# EAGLE design HEXTIr_v1 (EAGLE 7.7.0)
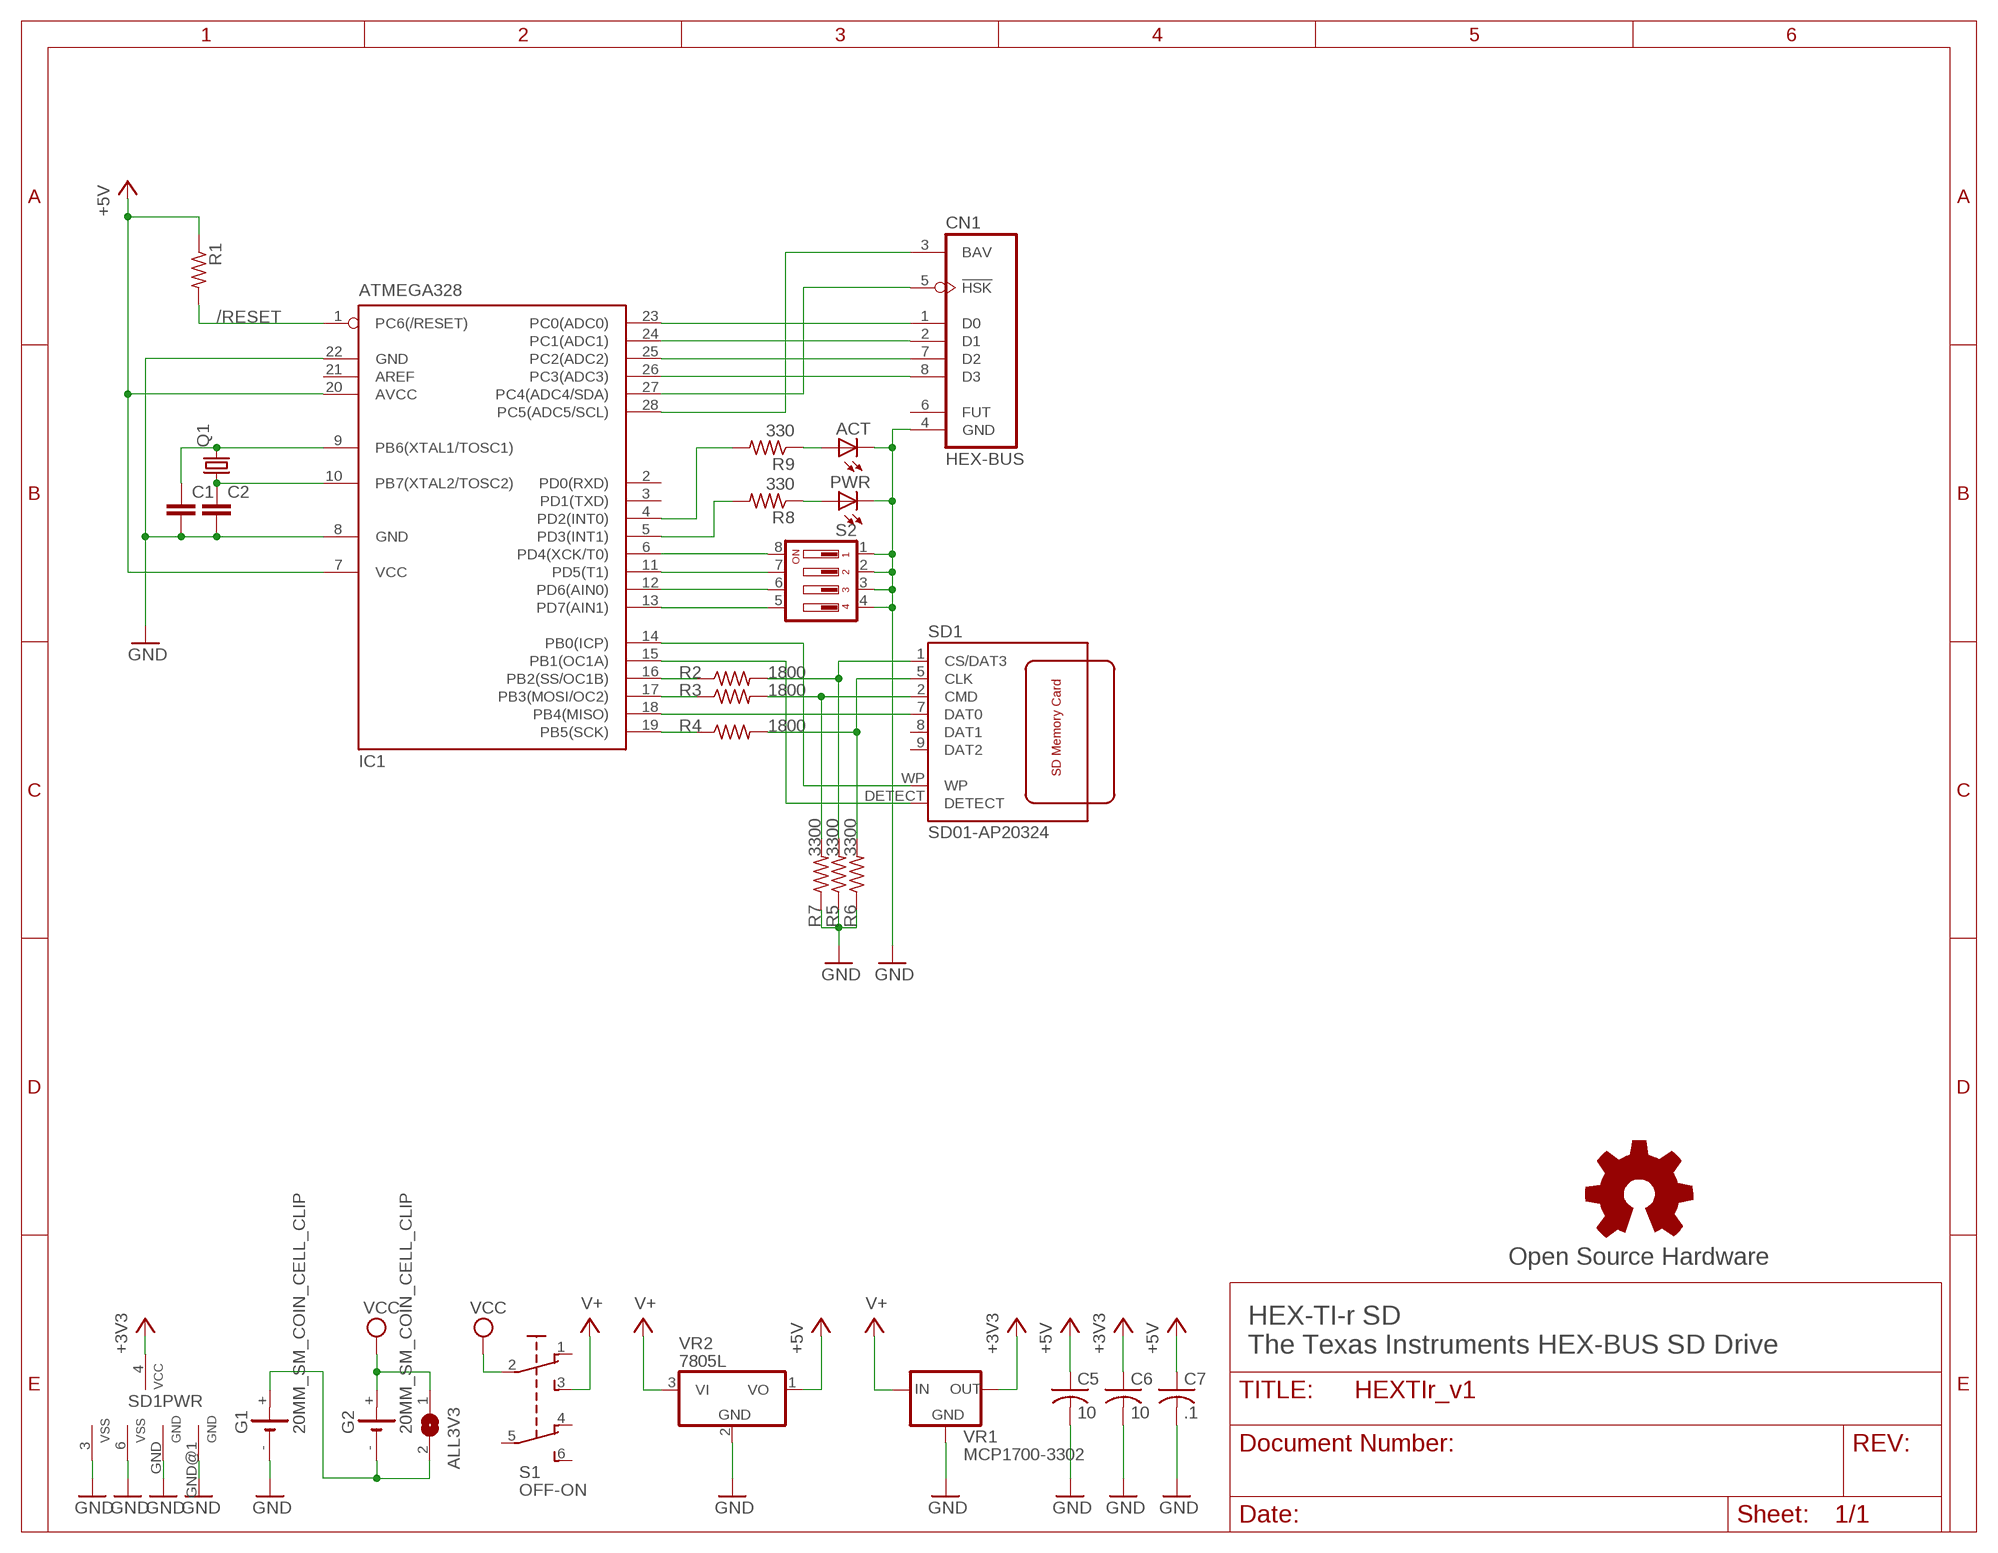
[diagram p0: schematic, sheet 1]

## Parts
ACT  LED3MM  [LED3MM]
ALL3V3  SJ  [SJ]
C1  C-EU025-024X044  [C025-024X044]
C2  C-EU025-024X044  [C025-024X044]
C5  10  C-US025-025X050  [C025-025X050]
C6  10  C-US025-025X050  [C025-025X050]
C7  .1  C-US025-025X050  [C025-025X050]
CN1  HEX-BUS  [HEX-BUS]
G1  20MM_SM_COIN_CELL_CLIP  [20MM_SM_COIN_CELL_CLIP]
G2  20MM_SM_COIN_CELL_CLIP  [20MM_SM_COIN_CELL_CLIP]
GOLD_ORB_SM1  Open Source Hardware  OSHWLOGOLOGO5MM  [OSHW_5MM]
IC1  ATMEGA328  MEGA8-P  [DIL28-3]
PWR  LED3MM  [LED3MM]
Q1  CRYSTALHC49U-V  [HC49U-V]
R1  R-US_0204/2V  [0204V]
R2  1800  R-US_0204/2V  [0204V]
R3  1800  R-US_0204/2V  [0204V]
R4  1800  R-US_0204/2V  [0204V]
R5  3300  R-US_0204/2V  [0204V]
R6  3300  R-US_0204/2V  [0204V]
R7  3300  R-US_0204/2V  [0204V]
R8  330  R-US_0204/2V  [0204V]
R9  330  R-US_0204/2V  [0204V]
S1  OFF-ON  TINY-SLIDE  [TINY-SLIDE]
S2  DP04  [DP-04]
SD1  SD01-AP20324  [SD01-AP20324]
VR1  MCP1700-3302  MCP1700TO92  [TO92]
VR2  7805L  [TO92]

## Nets
!HSK: CN1.5(!HSK) IC1.27(PC4(ADC4/SDA))
+3V3: C6.1 SD1.4(3V3) VR1.3(OUT)
+5V: C5.1 C7.1 IC1.7(VCC) IC1.20(AVCC) R1.1 VR2.1(VO)
/RESET: IC1.1(PC6(/RESET)) R1.2
B2: C1.1 IC1.9(PB6(XTAL1/TOSC1)) Q1.2
B3: C2.1 IC1.10(PB7(XTAL2/TOSC2)) Q1.1
BAV: CN1.3(BAV) IC1.28(PC5(ADC5/SCL))
D0: CN1.1(D0) IC1.23(PC0(ADC0))
D1: CN1.2(D1) IC1.24(PC1(ADC1))
D2: CN1.7(D2) IC1.25(PC2(ADC2))
D3: CN1.8(D3) IC1.26(PC3(ADC3))
GND: ACT.K(C) C1.2 C2.2 C5.2 C6.2 C7.2 CN1.4(GND) G1.- IC1.8(GND) IC1.22(GND) PWR.K(C) R5.1 R6.1 R7.1 S2.1 S2.2 S2.3 S2.4 SD1.3(VSS) SD1.6(VSS) SD1.GND SD1.GND@1(GND) VR1.1(GND) VR2.2(GND)
N$1: R2.2 R5.2 SD1.1(CS/DAT3)
N$2: R3.2 R7.2 SD1.2(CMD)
N$3: IC1.18(PB4(MISO)) SD1.7(DAT0)
N$4: R4.2 R6.2 SD1.5(CLK)
N$5: IC1.14(PB0(ICP)) SD1.WP
N$6: IC1.15(PB1(OC1A)) SD1.DETECT
N$7: ALL3V3.2 G1.+ G2.-
N$17: IC1.16(PB2(SS/OC1B)) R2.1
N$18: IC1.17(PB3(MOSI/OC2)) R3.1
N$19: IC1.19(PB5(SCK)) R4.1
N$20: IC1.13(PD7(AIN1)) S2.5
N$21: IC1.12(PD6(AIN0)) S2.6
N$22: IC1.11(PD5(T1)) S2.7
N$23: IC1.6(PD4(XCK/T0)) S2.8
N$24: IC1.5(PD3(INT1)) R8.2
N$25: IC1.4(PD2(INT0)) R9.2
N$26: ACT.A R9.1
N$27: PWR.A R8.1
V+: S1.3(S) VR1.2(IN) VR2.3(VI)
VCC: ALL3V3.1 G2.+ S1.2(P)
Unconnected: CN1.6(FUT) IC1.2(PD0(RXD)) IC1.3(PD1(TXD)) IC1.21(AREF) S1.1(O) S1.4(O1) S1.5(P1) S1.6(S1) SD1.8(DAT1) SD1.9(DAT2)

## Notes on the sheet
- HEX-TI-r SD
  The Texas Instruments HEX-BUS SD Drive

## Library data of the parts
ACT PWR = led:LED: LED OSRAM: - CHIPLED LG R971, LG N971, LY N971, LG Q971, LY Q971, LO R971, LY R971 LH N974, LH R974 LS Q976, LO Q976, LY Q976 LO Q996 - Hyper CHIPLED LW Q18S LB Q993, LB Q99A, LB R99A - SideLED LS A670, LO A670, LY A670, LG A670, LP A670 LB A673, LV A673, LT A673, LW A673 LH A674 LY A675 LS A676, LA A676, LO A676, LY A676, LW A676 LS A679, LY A679, LG A679 - Hyper Micro SIDELED® LS Y876, LA Y876, LO Y876, LY Y876 LT Y87S - SmartLED LW L88C, LW L88S LB L89C, LB L89S, LG L890 LS L89K, LO L89K, LY L89K LS L896, LA L896, LO L896, LY L896 - TOPLED LS T670, LO T670, LY T670, LG T670, LP T670 LSG T670, LSP T670, LSY T670, LOP T670, LYG T670 LG T671, LOG T671, LSG T671 LB T673, LV T673, LT T673, LW T673 LH T674 LS T676, LA T676, LO T676, LY T676, LB T676, LH T676, LSB T676, LW T676 LB T67C, LV T67C, LT T67C, LS T67K, LO T67K, LY T67K, LW E67C LS E67B, LA E67B, LO E67B, LY E67B, LB E67C, LV E67C, LT E67C LW T67C LS T679, LY T679, LG T679 LS T770, LO T770, LY T770, LG T770, LP T770 LB T773, LV T773, LT T773, LW T773 LH T774 LS E675, LA E675, LY E675, LS T675 LS T776, LA T776, LO T776, LY T776, LB T776 LHGB T686 LT T68C, LB T68C - Hyper Mini TOPLED® LB M676 - Mini TOPLED Santana® LG M470 LS M47K, LO M47K, LY M47K Source: http://www.osram.convergy.de LUXEON: - LUMILED® LXK2-PW12-R00, LXK2-PW12-S00, LXK2-PW14-U00, LXK2-PW14-V00 LXK2-PM12-R00, LXK2-PM12-S00, LXK2-PM14-U00 LXK2-PE12-Q00, LXK2-PE12-R00, LXK2-PE12-S00, LXK2-PE14-T00, LXK2-PE14-U00 LXK2-PB12-K00, LXK2-PB12-L00, LXK2-PB12-M00, LXK2-PB14-N00, LXK2-PB14-P00, LXK2-PB14-Q00 LXK2-PR12-L00, LXK2-PR12-M00, LXK2-PR14-Q00, LXK2-PR14-R00 LXK2-PD12-Q00, LXK2-PD12-R00, LXK2-PD12-S00 LXK2-PH12-R00, LXK2-PH12-S00 LXK2-PL12-P00, LXK2-PL12-Q00, LXK2-PL12-R00 Source: www.luxeon.com KINGBRIGHT: KA-3528ASYC Source: www.kingbright.com
ALL3V3 = jumper:SJ: SMD solder JUMPER
C1 C2 = rcl:C-EU: CAPACITOR, European symbol
C5-C7 = rcl:C-US: CAPACITOR, American symbol
CN1 = ti_cc40:HEX-BUS: TI HexBus Connector; OC_FARNELL: unknown; OC_NEWARK: unknown
G1 G2 = battery-jlb:20MM_SM_COIN_CELL_CLIP: Battery cell clip for CR927 Source: KEYSTONE ELECTRONICS CORP. www.keyelco.com, ASTORIA, N.Y. 11105-2017 PART ANME 10mm SM COIN CELl CLIP DWG NO. 3030
GOLD_ORB_SM1 = oshw:OSHWLOGO: The OSHW logo for PCB layout
IC1 = atmel:MEGA8-P: MICROCONTROLLER 8 Kbytes FLASH, 1 kbytes SRAM, 512 bytes EEPROM, USART, 4-channel 10 bit ADC, 2-channel 8 bit ADC Pin compatible with Atmega48, ATMega88, ATMega168 Source: avr.lbr; OC_FARNELL: unknown; OC_NEWARK: unknown
Q1 = crystal:CRYSTAL: CRYSTAL; OC_FARNELL: 1666969; OC_NEWARK: unknown
R1 = resistor:R-US_: RESISTOR, American symbol
R2-R9 = rcl:R-US_: RESISTOR, American symbol
S1 = switch-jlb:TINY-SLIDE: TINY SWITCH ON - MOM Source: http://www2.produktinfo.conrad.com/datenblaetter/700000-724999/705152-da-01-de-Subminiaturschalter_TL_36WO.pdf
S2 = switch-dil:DP04: DIL/CODE SWITCH; MPN: DP04; OC_FARNELL: 9471600; OC_NEWARK: 73J0027
SD1 = con-atom-sd:SD01-AP20324
VR1 = microchip-vr:MCP1700: MCP1700 Low Quiescent Current LDO Voltage Regulator
VR2 = linear:78*: Positive VOLTAGE REGULATOR Source: http://cache.national.com/ds/LM/LM78L05.pdf http://www.fairchildsemi.com/ds/LM/LM7805.pdf

## Board
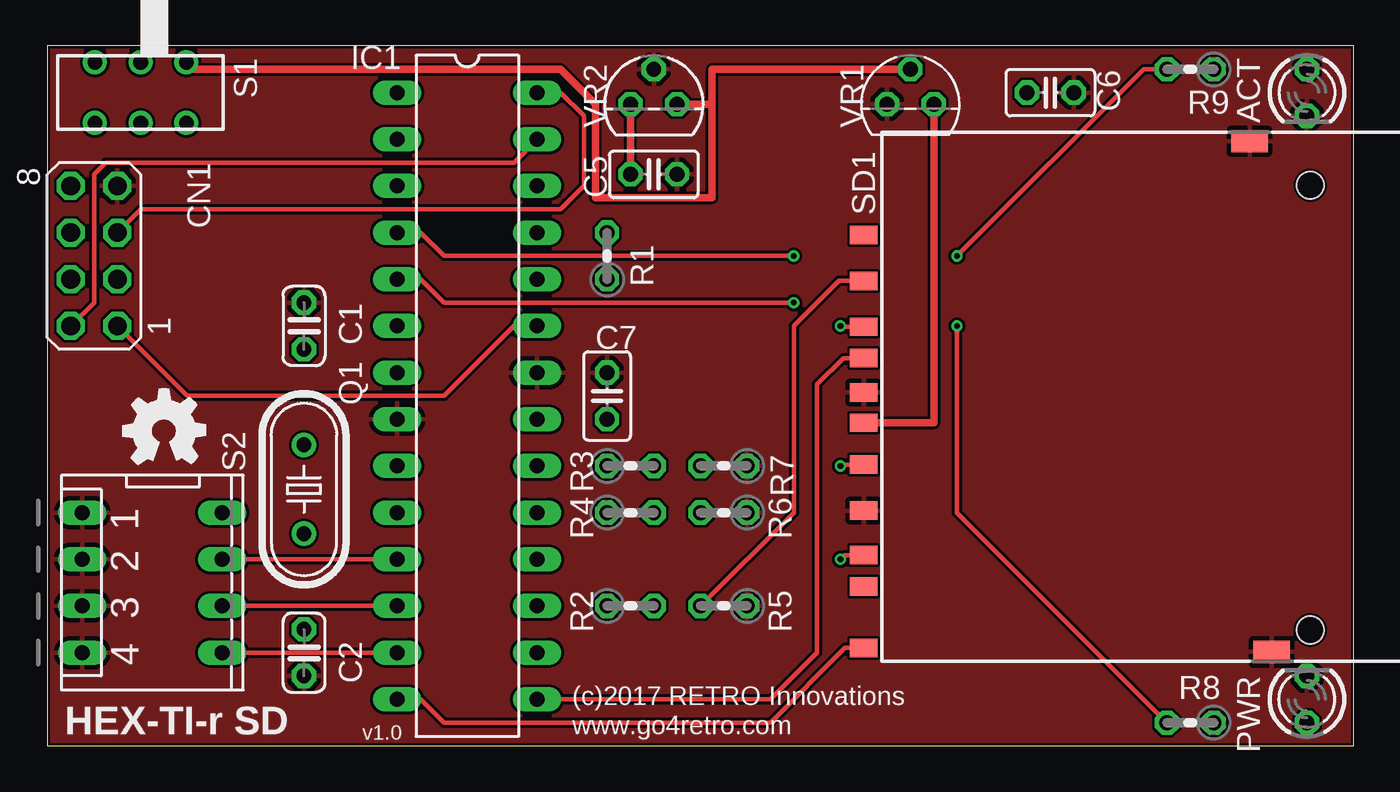
[diagram p1: board, top side]
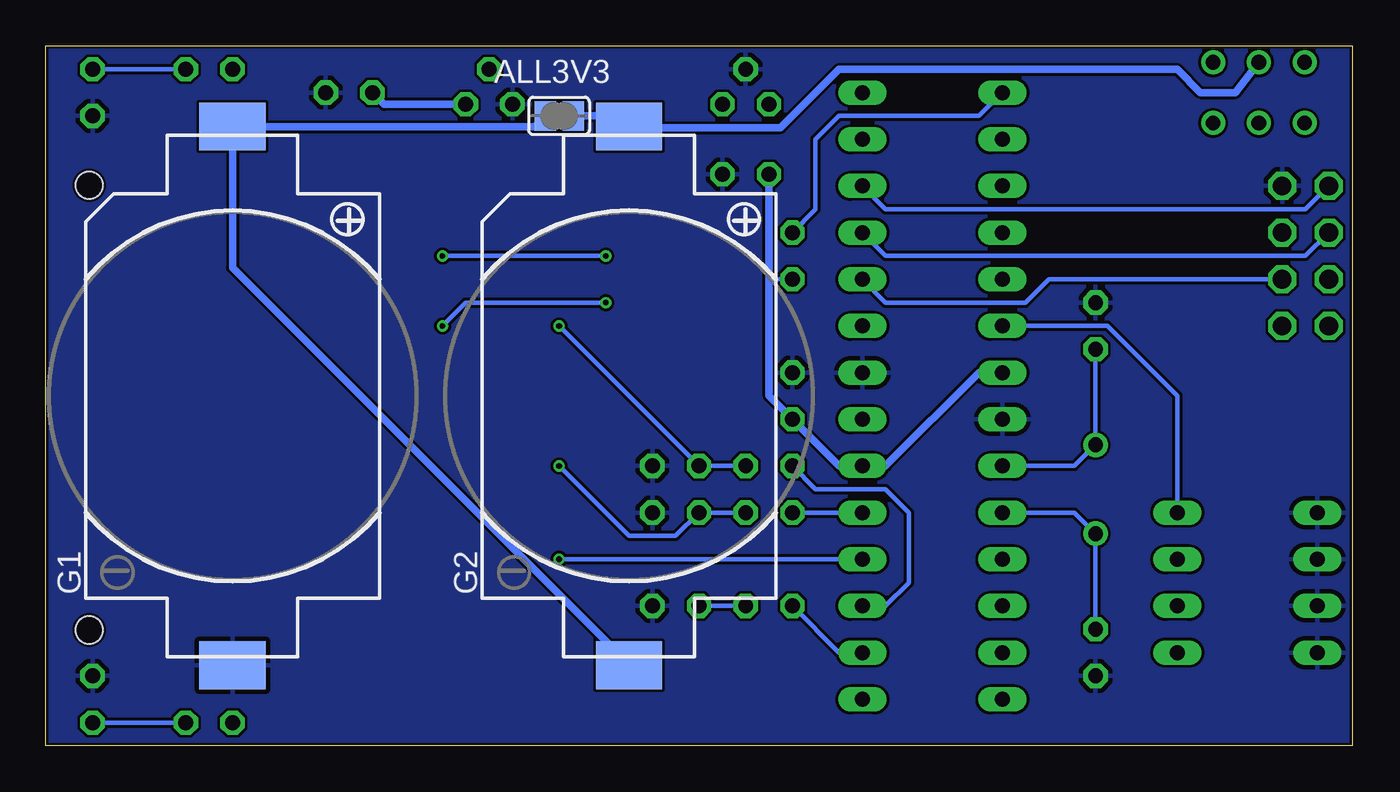
[diagram p2: board, bottom side, seen from below]

Size 71.12 x 38.1 mm. Coordinates in mm from the lower left corner, seen from the top.
Outline: 0,0 71.12,0 71.12,38.1 0,38.1 0,0
Copper layers (1*16): Top 0.035mm / dielectric 1.5mm / Bottom 0.035mm
Design rules "hackvana": minimum track width 6mil, minimum drill 0.3mm, track to track 6mil, track to pad 6mil, pad to pad 6mil, via to via 6mil, smd to smd 0mil, copper to edge 6mil, drill to drill 6mil, minimum pad ring 10mil, minimum via ring 6mil, stop-mask expansion 2mil, vias tented up to drill 100mil, thermal gap 10mil

### Footprints (pad centres in the part's own frame; a part is rotated, then mirrored left to right if it is on the bottom)
LED3MM = drill 0.813 octagon: A -1.27,0; K 1.27,0
SJ = smd 1.168 x 1.6: 1 -0.762,0; 2 0.762,0
C025-024X044 = drill 0.813 octagon: 1 -1.27,0; 2 1.27,0
C025-025X050 = drill 0.813 octagon: 1 -1.27,0; 2 1.27,0
HEX-BUS = drill 1.016 octagon: 1 -3.81,-1.27; 2 -1.27,-1.27; 3 1.27,-1.27; 4 3.81,-1.27; 5 -3.81,1.27; 6 -1.27,1.27; 7 1.27,1.27; 8 3.81,1.27
20MM_SM_COIN_CELL_CLIP = smd 2.591 x 3.607: + 14.656,0; - -14.656,0
DIL28-3 = drill 0.813 long: 1 -16.51,-3.81; 2 -13.97,-3.81; 3 -11.43,-3.81; 4 -8.89,-3.81; 5 -6.35,-3.81; 6 -3.81,-3.81; 7 -1.27,-3.81; 8 1.27,-3.81; 9 3.81,-3.81; 10 6.35,-3.81; 11 8.89,-3.81; 12 11.43,-3.81; 13 13.97,-3.81; 14 16.51,-3.81; 15 16.51,3.81; 16 13.97,3.81; 17 11.43,3.81; 18 8.89,3.81; 19 6.35,3.81; 20 3.81,3.81; 21 1.27,3.81; 22 -1.27,3.81; 23 -3.81,3.81; 24 -6.35,3.81; 25 -8.89,3.81; 26 -11.43,3.81; 27 -13.97,3.81; 28 -16.51,3.81
HC49U-V = drill 0.813: 1 -2.413,0; 2 2.413,0
0204V = drill 0.813 octagon: 1 -1.27,0; 2 1.27,0
TINY-SLIDE = drill 0.8: 1 -2.489,1.65; 2 0,1.65; 3 2.489,1.65; 4 -2.489,-1.65; 5 0,-1.65; 6 2.489,-1.65
DP-04 = drill 0.813 long: 1 -3.81,-3.81; 2 -1.27,-3.81; 3 1.27,-3.81; 4 3.81,-3.81; 5 3.81,3.81; 6 1.27,3.81; 7 -1.27,3.81; 8 -3.81,3.81
SD01-AP20324 = smd 1 x 1.5: 1 -7.535,-13.97; 2 -5.035,-13.97; 3 -1.46,-13.97; 4 0.19,-13.97; 5 2.465,-13.97; 6 4.965,-13.97; 7 7.395,-13.97; 8 9.095,-13.97; 9 -10.035,-13.97; DETECT -3.335,-13.97; WP 12.445,-13.97 | smd 1.2 x 2: GND 12.665,8.24; GND@1 -15.135,7.04 | hole 1.5: -12.735,10.34; 11.465,10.34
TO92 = drill 0.813 octagon: 1 -1.27,0; 2 0,1.905; 3 1.27,0

### Placement (x,y rotation side)
ACT  68.58,35.56 270 top
ALL3V3  43.18,34.29 180 bottom
C1  13.97,22.86 90 top
C2  13.97,5.08 270 top
C5  33.02,31.11 0 top
C6  54.61,35.56 0 top
C7  30.48,19.05 90 top
CN1  2.54,26.67 90 top
G1  60.96,19.05 90 bottom
G2  39.37,19.05 90 bottom
GOLD_ORB_SM1  6.35,17.14 0 top
IC1  22.86,19.05 270 top
PWR  68.58,2.54 90 top
Q1  13.97,13.97 90 top
R1  30.48,26.67 90 top
R2  31.75,7.62 0 top
R3  31.75,15.24 0 top
R4  31.75,12.7 0 top
R5  36.83,7.62 180 top
R6  36.83,12.7 180 top
R7  36.83,15.24 180 top
R8  62.23,1.27 180 top
R9  62.23,36.83 180 top
S1  5.08,35.56 0 top
S2  5.72,8.89 270 top
SD1  58.42,17.78 270 top
VR1  46.99,34.92 0 top
VR2  33.02,34.92 0 top

### Tracks (layer width: path | path; a pad name or v marks a point on that pad's centre or on a via)
!HSK
  Top 0.254: CN1.5 2.54,24.13 2.54,31.11 3.18,31.75 25.4,31.75 IC1.27
+3V3
  Top 0.406: SD1.4 48.26,17.59 VR1.3
  Bottom 0.406: VR1.3 52.7,34.92 C6.1
+5V
  Top 0.406: C5.1 VR2.1
  Bottom 0.254: R1.1 31.75,25.4
  Bottom 0.406: IC1.7 20.32,20.32 25.4,15.24 IC1.20 27.94,15.24 C7.1 31.75,19.05 31.75,25.4 C5.1
/RESET
  Bottom 0.254: IC1.1 20.32,34.29 27.94,34.29 29.21,33.02 29.21,29.21 R1.2
B2
  Bottom 0.254: IC1.9 15.11,15.24 Q1.2 C1.1
B3
  Bottom 0.254: IC1.10 15.11,12.7 Q1.1 C2.1
BAV
  Top 0.254: CN1.3 5.08,29.21 27.94,29.21 29.21,30.48 29.21,34.29 27.94,35.56 IC1.28
D0
  Top 0.254: CN1.1 7.62,19.05 21.59,19.05 25.4,22.86 IC1.23
D1
  Bottom 0.254: CN1.2 16.51,25.4 17.78,24.13 25.4,24.13 IC1.24
D2
  Bottom 0.254: CN1.7 2.54,26.67 25.4,26.67 IC1.25
D3
  Bottom 0.254: CN1.8 2.54,29.21 25.4,29.21 IC1.26
GND
  pour Bottom: 0,38.1 0,0 71.12,0 71.12,38.1
  pour Top: 0,38.1 0,0 71.12,0 71.12,38.1
N$1
  Top 0.254: SD1.1 43.09,25.31 40.64,22.86 40.64,12.7 R5.2
  Bottom 0.254: R2.2 R5.2
N$2  (via drill 0.3)
  Top 0.254: SD1.2 43.14,22.81 v43.18,22.86
  Bottom 0.254: R3.2 R7.2 v43.18,22.86
N$3  (via drill 0.3)
  Top 0.254: SD1.7 43.41,10.38 v43.18,10.16
  Bottom 0.254: IC1.18 v43.18,10.16
N$4  (via drill 0.3)
  Top 0.254: SD1.5 43.26,15.31 v43.18,15.24
  Bottom 0.254: v43.18,15.24 39.37,11.43 36.83,11.43 R6.2 R4.2
N$5
  Top 0.254: IC1.14 20.32,2.54 21.59,1.27 39.37,1.27 43.44,5.33 SD1.WP
N$6
  Top 0.254: IC1.15 39.37,2.54 41.91,5.08 41.91,19.68 43.34,21.11 SD1.DETECT
N$7
  Bottom 0.406: G2.- 39.37,4.44 60.96,26.03 G1.+ 44.53,33.71 ALL3V3.2
N$17
  Bottom 0.254: IC1.16 27.94,5.08 R2.1
N$18
  Bottom 0.254: R3.1 29.21,13.97 25.4,13.97 24.13,12.7 24.13,8.89 25.4,7.62 IC1.17
N$19
  Bottom 0.254: IC1.19 R4.1
N$20
  Top 0.254: IC1.13 S2.5
N$21
  Top 0.254: IC1.12 S2.6
N$22
  Top 0.254: IC1.11 S2.7
N$23
  Bottom 0.254: IC1.6 13.34,22.86 9.53,19.05 S2.8
N$24  (via drill 0.3)
  Top 0.254: IC1.5 20.32,25.4 21.59,24.13 v40.64,24.13 | R8.2 49.53,12.7 v49.53,22.86
  Bottom 0.254: v49.53,22.86 48.26,24.13 v40.64,24.13
N$25  (via drill 0.3)
  Top 0.254: IC1.4 20.32,27.94 21.59,26.67 v40.64,26.67 | R9.2 59.69,36.83 v49.53,26.67
  Bottom 0.254: v49.53,26.67 v40.64,26.67
N$26
  Bottom 0.254: ACT.A R9.1
N$27
  Bottom 0.254: PWR.A R8.1
V+
  Top 0.406: S1.3 7.95,36.83 27.94,36.83 29.85,34.92 29.85,29.84 36.2,29.84 36.2,34.92 | VR1.2 36.2,36.83 36.2,34.92 | VR2.3 36.2,34.92
VCC
  Bottom 0.406: ALL3V3.1 39.37,34.29 | 39.37,34.29 G2.+ | 39.37,34.29 38.73,33.65 31.12,33.65 27.94,36.83 9.53,36.83 8.26,35.56 6.35,35.56 S1.2

### Text on the board
tNames: (c)2017 RETRO Innovations | HEX-TI-r SD | v1.0 | www.go4retro.com